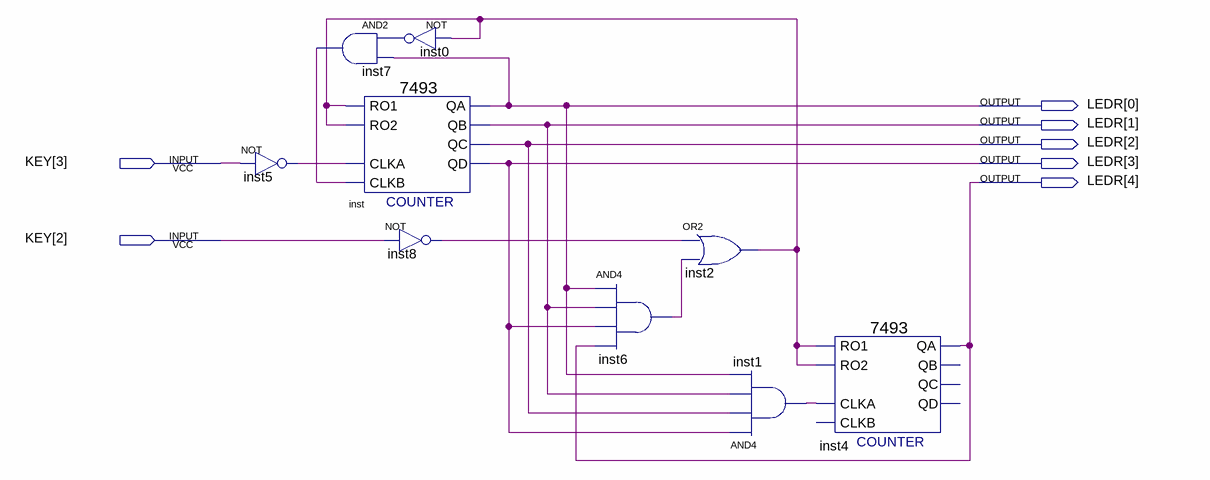
[diagram p0: schematic sheet]
// Quartus schematic skracanie_licznikow.bdf as structural Verilog: 9 symbols, 7 pins
module skracanie_licznikow (
  input  [3:2] KEY,
  output [4:0] LEDR
);

  wire inst0_out, inst1_out, inst2_out, inst5_out, inst6_out, inst7_out, inst8_out;

  not inst5 (inst5_out, KEY[3]);
  and inst7 (inst7_out, inst0_out, LEDR[0]);
  \7493  inst (
    .RO1(inst2_out), .RO2(inst2_out), .CLKA(inst5_out), .CLKB(inst7_out), .QC(LEDR[2]), .QB(LEDR[1]),
    .QA(LEDR[0]), .QD(LEDR[3]));
  not inst0 (inst0_out, inst2_out);
  not inst8 (inst8_out, KEY[2]);
  and inst6 (inst6_out, LEDR[0], LEDR[1], LEDR[3], LEDR[4]);
  or inst2 (inst2_out, inst8_out, inst6_out);
  and inst1 (inst1_out, LEDR[3], LEDR[2], LEDR[1], LEDR[0]);
  \7493  inst4 (.RO1(inst2_out), .RO2(inst2_out), .CLKA(inst1_out), .QA(LEDR[4]));  // open: CLKB, QC, QB, QD
endmodule
